# Altium schematic sheet Displays.SchDoc
size B
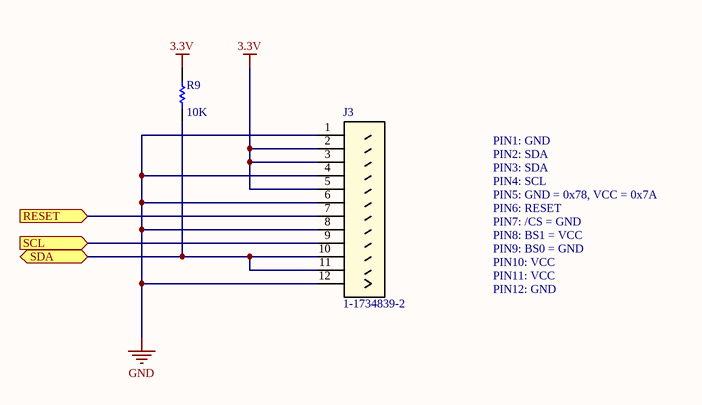
[diagram p0: Displays.SchDoc]

## Parts
J3  1-1734839-2  [CONN_1-1734592-2]
R9  value 10K  [6-0805_N]

## Ports
RESET (in), SCL (in), SDA (bidir)

## Nets
3.3V: J3.2 J3.3 J3.5 R9.1
GND: J3.1 J3.4 J3.6 J3.8 J3.12
RESET: J3.7 ; port RESET
SCL: J3.9 ; port SCL
SDA: J3.10 J3.11 R9.2 ; port SDA

## Notes on the sheet
- PIN1: GND
- PIN2: SDA
- PIN3: SDA
- PIN4: SCL
- PIN5: GND = 0x78, VCC = 0x7A
- PIN7: /CS = GND
- PIN6: RESET
- PIN8: BS1 = VCC
- PIN9: BS0 = GND
- PIN10: VCC
- PIN11: VCC
- PIN12: GND

## Library data of the parts
J3 = 1-1734839-2: Imported; Manufacturer_Name: Tyco Electronics Amp; Vendor: Tyco Electronics; Supersection: Connectors; Section: General Purpose; C: Copyright (C) 2015 Accelerated Designs. All rights reserved; Manufacturer_Part_Number: 1-1734839-2; Family: Headers and PCB Receptacles; Copyright: Copyright (C) 2015 Accelerated Designs. All rights reserved; RS_Part_Number: 7188674; Value: Value; Type: Type; RefDes: RefDes
R9 = Res1: Resistor; Published: 8-Jun-2000; LatestRevisionDate: 17-Jul-2002; LatestRevisionNote: Re-released for DXP Platform.; PackageReference: AXIAL-0.3; Publisher: Altium Limited; PackageDescription: Axial Device, Thru-Hole; 2 Leads; 0.3 in Pin Spacing